# Altium schematic sheet Blackbox_Brightness_Sensor_Schematic.SchDoc
size A4; DocumentNumber: 1; SheetNumber: 1; SheetTotal: 2
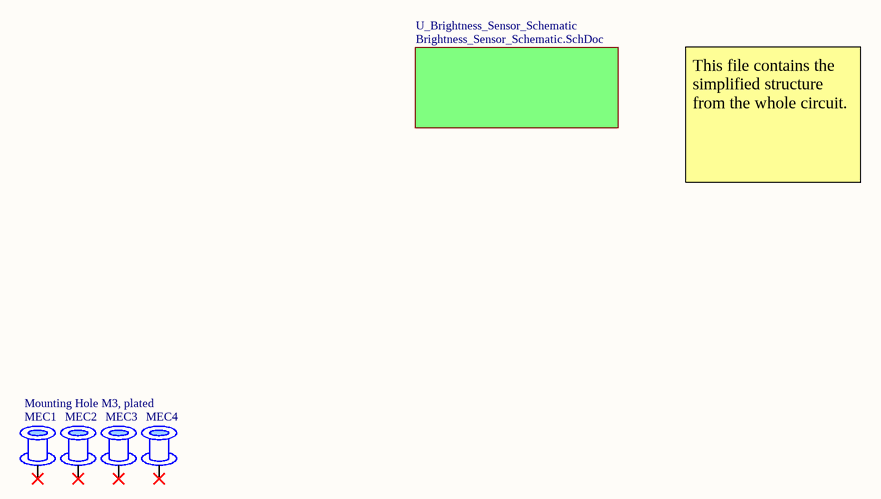
[diagram p0: Blackbox_Brightness_Sensor_Schematic.SchDoc]

## Parts
MEC1  Mounting Hole M3, plated  [Mounting Hole M3, plated]
MEC2  Mounting Hole M3, plated  [Mounting Hole M3, plated]  (value not drawn)
MEC3  Mounting Hole M3, plated  [Mounting Hole M3, plated]  (value not drawn)
MEC4  Mounting Hole M3, plated  [Mounting Hole M3, plated]  (value not drawn)

## Sub-sheets
U_Brightness_Sensor_Schematic = Brightness_Sensor_Schematic.SchDoc: no entries

## Nets

Not connected (* = marked no-connect by the designer): MEC1 1*; MEC2 1*; MEC3 1*; MEC4 1*

## Notes on the sheet
- This file contains the simplified structure from the whole circuit.
- Date:
- Title of drawing:
- Time:
- Drawn by:
- Project:
- Revision:
- Institut:
- Departement:
- Page:
- from:
- File:

## Library data of the parts
MEC1-MEC4 = Mounting Hole M3, plated: Mounting Hole for M3 Screw, plated to connect signal